# EAGLE design 102_Buzzer_Rev020000 (EAGLE 9.6.2)
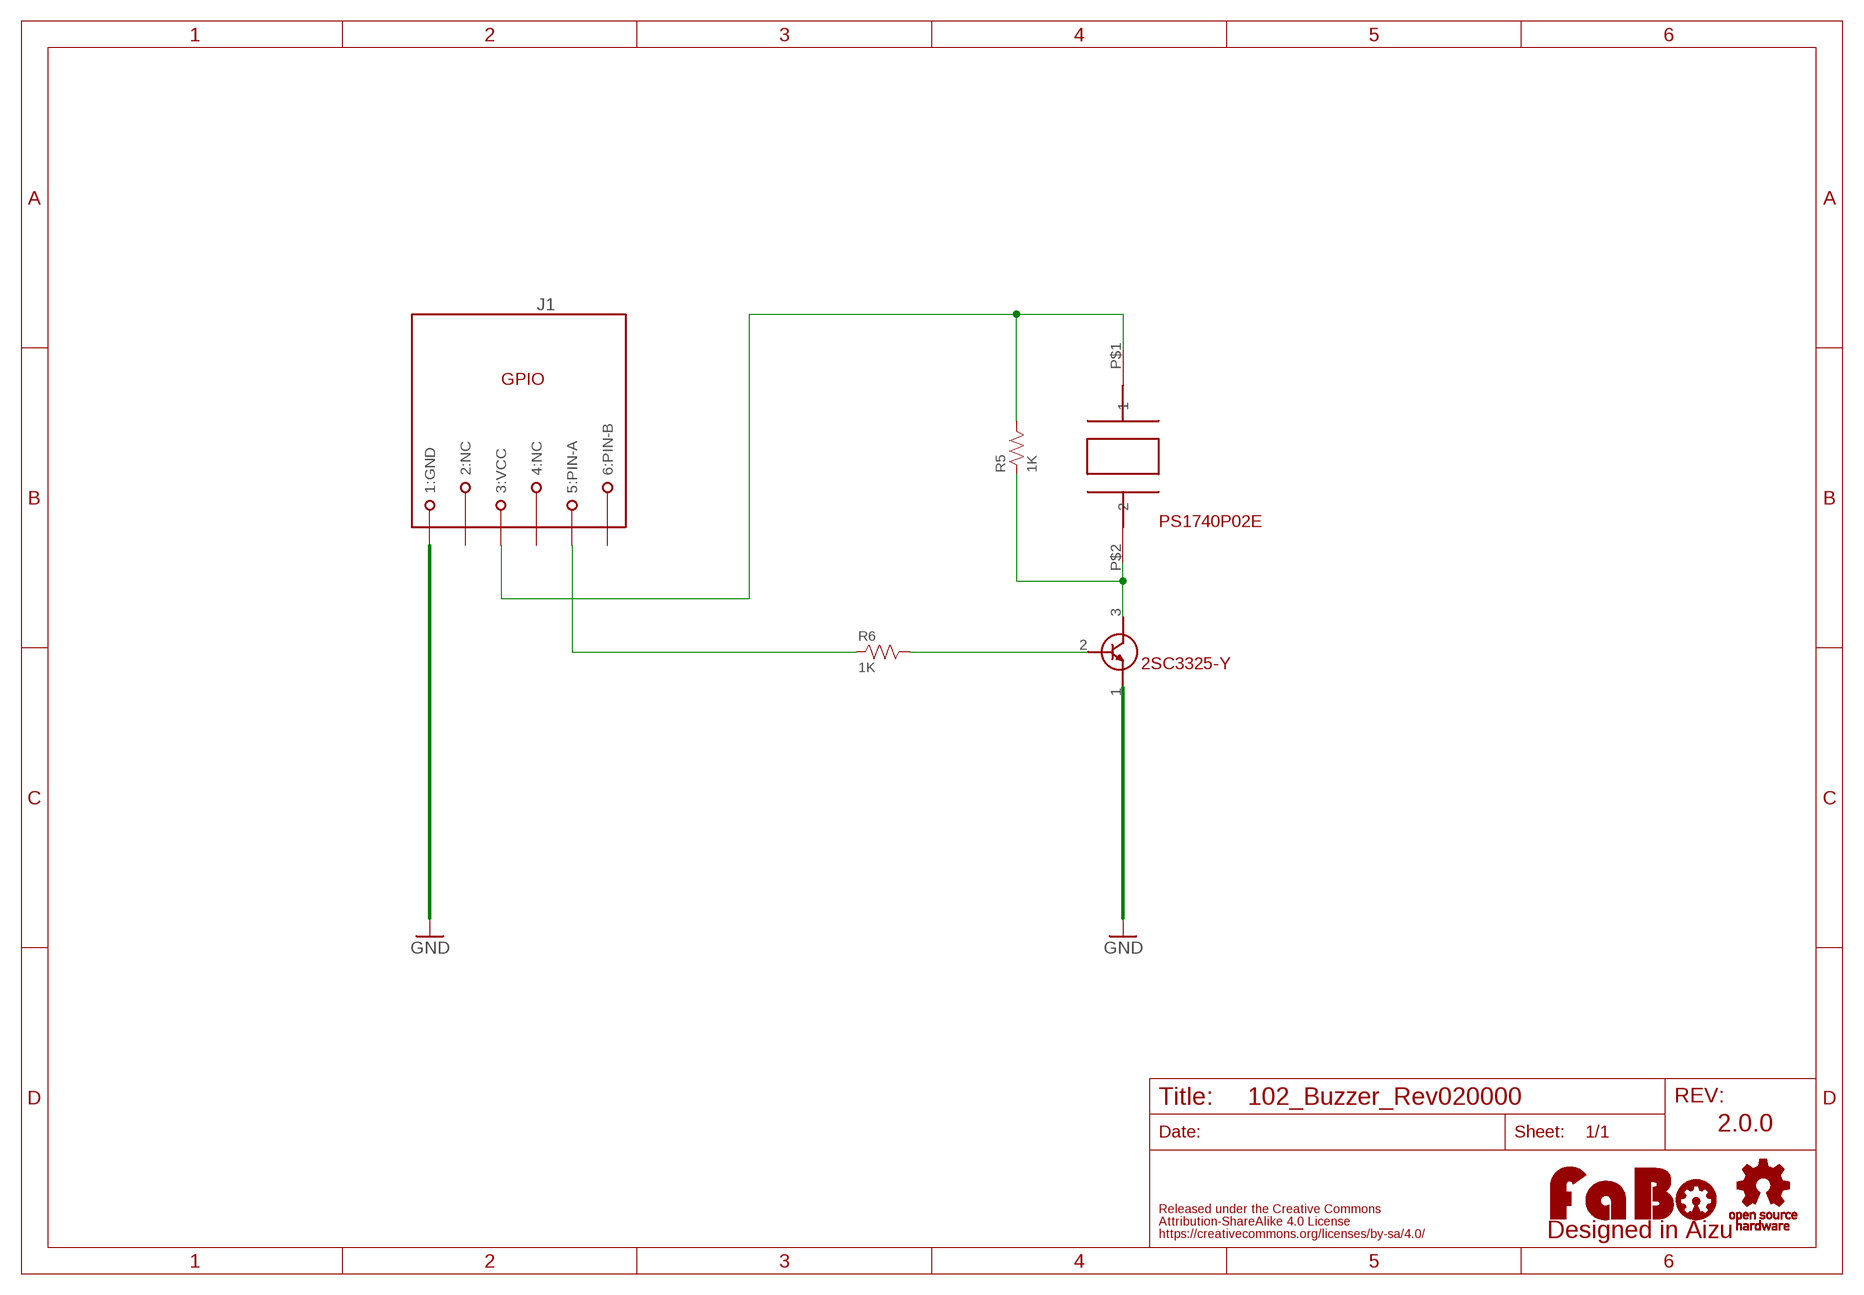
[diagram p0: schematic, sheet 1]

## Parts
J1  MODULAR-JACK-6P-RJ11_GPIO  [7002-6PXC-X]
LOGO1  LOGO_FABO-M  [LOGO_FABO_M]
R5  1K  RESISTOR-0603  [0603]
R6  1K  RESISTOR-0603  [0603]
T1  2SC3325-Y  [SC-59]
U1  PS1740P02E  [PS1740P02E]
U$2  LOGO_OSHW-M_BOTTOM  [LOGO_OSHW_M_BOTTOM]

## Nets
GND: J1.1(1:GND) T1.1(E)
N$6: J1.5(5:PIN-A) R6.1
N$9: J1.3(3:VCC) R5.2 U1.P$1
N$10: R5.1 T1.3(C) U1.P$2
N$11: R6.2 T1.2(B)
Unconnected: J1.2(2:NC) J1.4(4:NC) J1.6(6:PIN-B)

## Notes on the sheet
- PS1740P02E
- 2.0.0

## Library data of the parts
J1 = FaBo-Connetor:MODULAR-JACK-6P-RJ11_GPIO
LOGO1 = component:LOGO_FABO
R5 R6 = FaBo-Resistors:RESISTOR: RESISTOR
T1 = FaBo-Transistor:2SC3325-Y
U1 = FaBo:PS1740P02E
U$2 = FaBo-etc:LOGO_OSHW

## Board
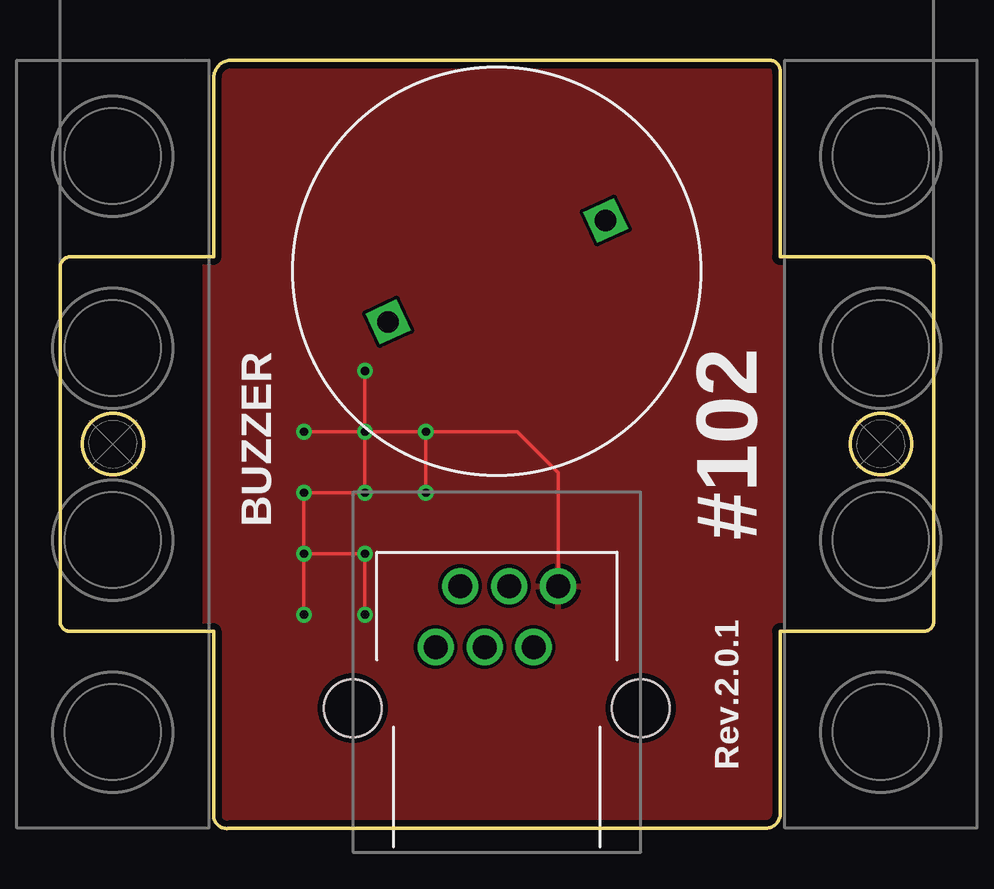
[diagram p1: board, top side]
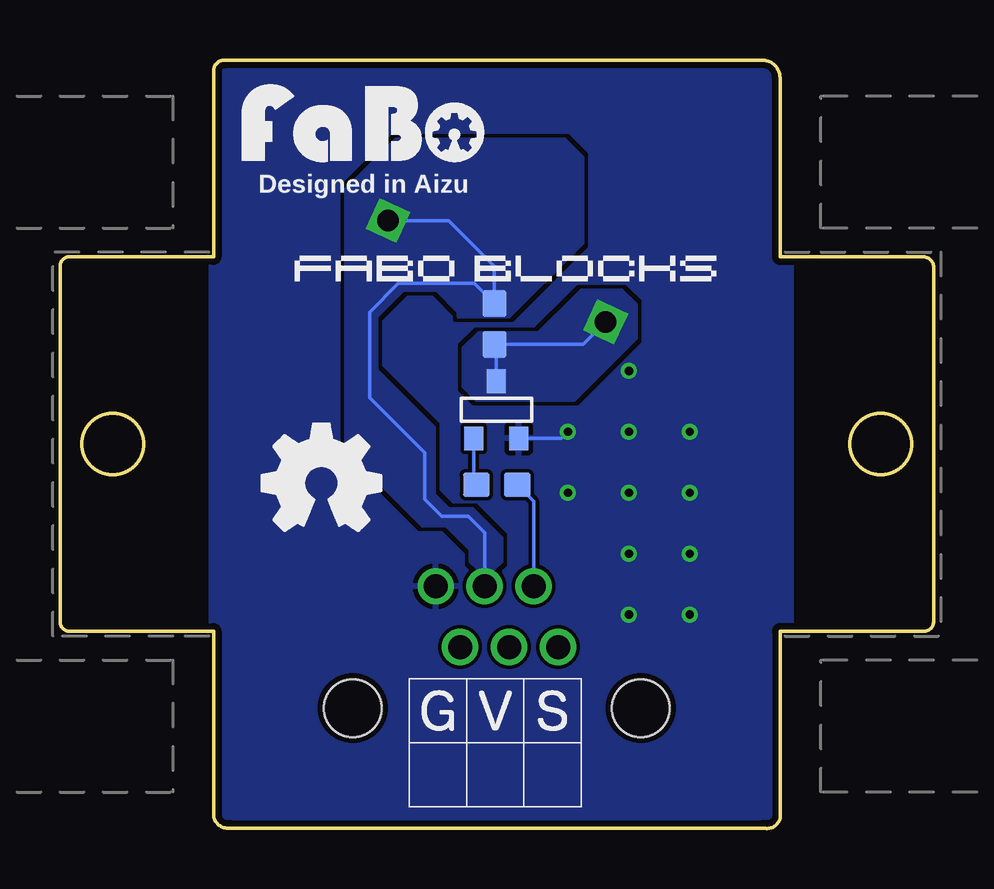
[diagram p2: board, bottom side, seen from below]

Size 36.4 x 32.02 mm. Coordinates in mm from the lower left corner, seen from the top.
Outline: 29.3,0.02 7.1,0.02 arc-90 6.4,0.42 6.4,8.22 0.4,8.22 arc-90 0,8.62 0,23.32 arc-90 0.4,23.82 6.4,23.82 6.4,31.22 arc-90 7.1,32.02 29.5,32.02 arc-99 30,31.52 30,23.82 36,23.82 arc-90 36.4,23.42 36.4,8.62 arc-90 36,8.22 30,8.22 30,0.52 arc-90 29.3,0.02
Outline: circle at 34.2,16.02 radius 1.27
Outline: circle at 2.2,16.02 radius 1.27
Copper layers (1*16): Top 0.035mm / dielectric 1.6mm / Bottom 0.035mm
Design rules "PCBway": minimum track width 6mil, minimum drill 12mil, track to track 6mil, track to pad 6mil, pad to pad 6mil, via to via 6mil, smd to smd 6mil, copper to edge 10mil, drill to drill 10mil, minimum pad ring 10mil, minimum via ring 6mil, stop-mask expansion 2mil, vias tented up to drill 100mil, thermal gap 8mil

### Footprints (pad centres in the part's own frame; a part is rotated, then mirrored left to right if it is on the bottom)
7002-6PXC-X = drill 1: 1 2.55,5.08; 2 1.53,2.54; 3 0.51,5.08; 4 -0.51,2.54; 5 -1.53,5.08; 6 -2.55,2.54 | hole 2.4: -6,0; 6,0
0603 = smd 1.1 x 1: 1 -0.85,0; 2 0.85,0
SC-59 = smd 0.787 x 0.991: 1 -0.914,1.168; 2 0.965,1.168; 3 0.025,-1.219
PS1740P02E = drill 0.9 square: P$1 0,5; P$2 0,-5

### Placement (x,y rotation side)
J1  18.2,5.02 0 top
LOGO1  23.78,27.39 0 bottom
R5  18.3,21.02 90 bottom
R6  18.2,14.32 180 bottom
T1  18.2,17.42 180 bottom
U1  18.2,23.22 295 top
U$2  25.5,14.4 0 top
U$3  [4-1BLOCK]  2.2,16.02 0 top
U$4  [4-1BLOCK]  34.2,16.02 180 top

### Tracks (layer width: path | path; a pad name or v marks a point on that pad's centre or on a via)
GND  (via drill 0.35)
  Top 0.152: v15.24,16.53 19.05,16.53 20.75,14.83 J1.1 | v10.16,8.91 v10.16,11.45 | v10.16,11.45 v12.7,11.45 v12.7,8.91 | v10.16,11.45 v10.16,13.99 v12.7,13.99 v12.7,16.53 | v12.7,16.53 v15.24,16.53 | v15.24,16.53 v15.24,13.99 | v12.7,16.53 v10.16,16.53 | v12.7,16.53 v12.7,19.07
  Bottom 0.152: T1.1 15.52,16.25 v15.24,16.53
  pour Bottom (isolate 0.152, rank 6): 5.9,0.02 30.14,0.02 30.14,33.09 5.9,33.09
  pour Top (isolate 0.152): 6,0.02 30.14,0.02 30.14,32.69 6,32.69
N$6
  Bottom 0.152: R6.1 16.67,13.64 J1.5
N$9
  Bottom 0.152: J1.3 18.71,12.33 19.4,13.02 20.5,13.02 21.2,13.72 21.2,15.65 23.5,17.95 23.5,21.52 22.3,22.72 19.15,22.72 R5.2 18.3,23.42 20.21,25.33 U1.P$1
  pour Bottom (no thermals): 14.62,27.96 15.38,28.72 22.41,28.72 24.5,26.63 24.5,15.82 21.3,12.62 20.3,12.62 19.3,11.62 19.3,11.12 19,10.82 18.3,10.82 18,11.12 18,12.12 19.2,13.32 20.2,13.32 20.8,13.92 20.8,16.72 23.2,19.12 23.2,21.32 22.1,22.42 20.7,22.42 19.8,21.52 19.8,21.32 17.68,21.32 14.62,24.38
N$10
  Bottom 0.152: 18.3,18.71 T1.3 18.23,20 18.35,20.12 R5.1 14.61,20.17 U1.P$2
  pour Bottom (no thermals): 12.4,20.42 12.4,21.84 12.99,22.43 14.69,22.43 14.92,22.2 16.47,20.65 17.44,20.65 18.97,20.65 19.6,20.02 19.6,18.4 19.04,17.84 14.98,17.84
N$11
  Bottom 0.152: R6.2 19.17,14.44 T1.2

### Text on the board
tPlace: BUZZER | #102 | Rev.2.0.1
bPlace: Designed in Aizu
Document: 102 BUZZER Rev2.0.1 / 2022/08/30
tDocu: PS1740P02E | LP2985-18
bDocu: LP2985-33